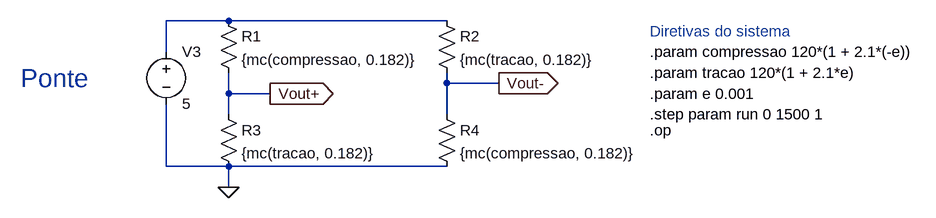
[diagram p0: schematic questaoB_T3.asc]
questaoB_T3.asc, the LTspice schematic file:
Version 4
SHEET 1 1024 1236
WIRE -128 640 -224 640
WIRE 208 640 -128 640
WIRE -224 688 -224 640
WIRE 208 736 208 720
WIRE 288 736 208 736
WIRE -128 752 -128 720
WIRE -64 752 -128 752
WIRE -128 784 -128 752
WIRE 208 784 208 736
WIRE -224 864 -224 768
WIRE -128 864 -224 864
WIRE 208 864 -128 864
WIRE -128 896 -128 864
FLAG -64 752 Vout+
IOPIN -64 752 Out
FLAG 288 736 Vout-
IOPIN 288 736 Out
FLAG -128 896 0
SYMBOL voltage -224 672 R0
WINDOW 123 0 0 Left 0
WINDOW 39 0 0 Left 0
SYMATTR InstName V3
SYMATTR Value 5
SYMBOL res -144 624 R0
SYMATTR InstName R1
SYMATTR Value {mc(compressao, 0.182)}
SYMBOL res -144 768 R0
SYMATTR InstName R3
SYMATTR Value {mc(tracao, 0.182)}
SYMBOL res 192 624 R0
SYMATTR InstName R2
SYMATTR Value {mc(tracao, 0.182)}
SYMBOL res 192 768 R0
SYMATTR InstName R4
SYMATTR Value {mc(compressao, 0.182)}
TEXT 520 752 Left 2 !.param e 0.001
TEXT 520 808 Left 2 !.op
TEXT 520 688 Left 2 !.param compressao 120*(1 + 2.1*(-e))
TEXT 520 720 Left 2 !.param tracao 120*(1 + 2.1*e)
TEXT -448 728 Left 4 ;Ponte
TEXT 520 656 Left 2 ;Diretivas do sistema
TEXT 520 784 Left 2 !.step param run 0 1500 1

The netlist it stands for:
* questaoB_T3.asc
V3 N001 0 5
R1 N001 Vout+ {mc(compressao, 0.182)}
R3 Vout+ 0 {mc(tracao, 0.182)}
R2 N001 Vout- {mc(tracao, 0.182)}
R4 Vout- 0 {mc(compressao, 0.182)}
.param e 0.001
.op
.param compressao 120*(1 + 2.1*(-e))
.param tracao 120*(1 + 2.1*e)
* Ponte
* Diretivas do sistema
.step param run 0 1500 1
.backanno
.end